# EAGLE schematic DX HRII2 (EAGLE 7.6.0)
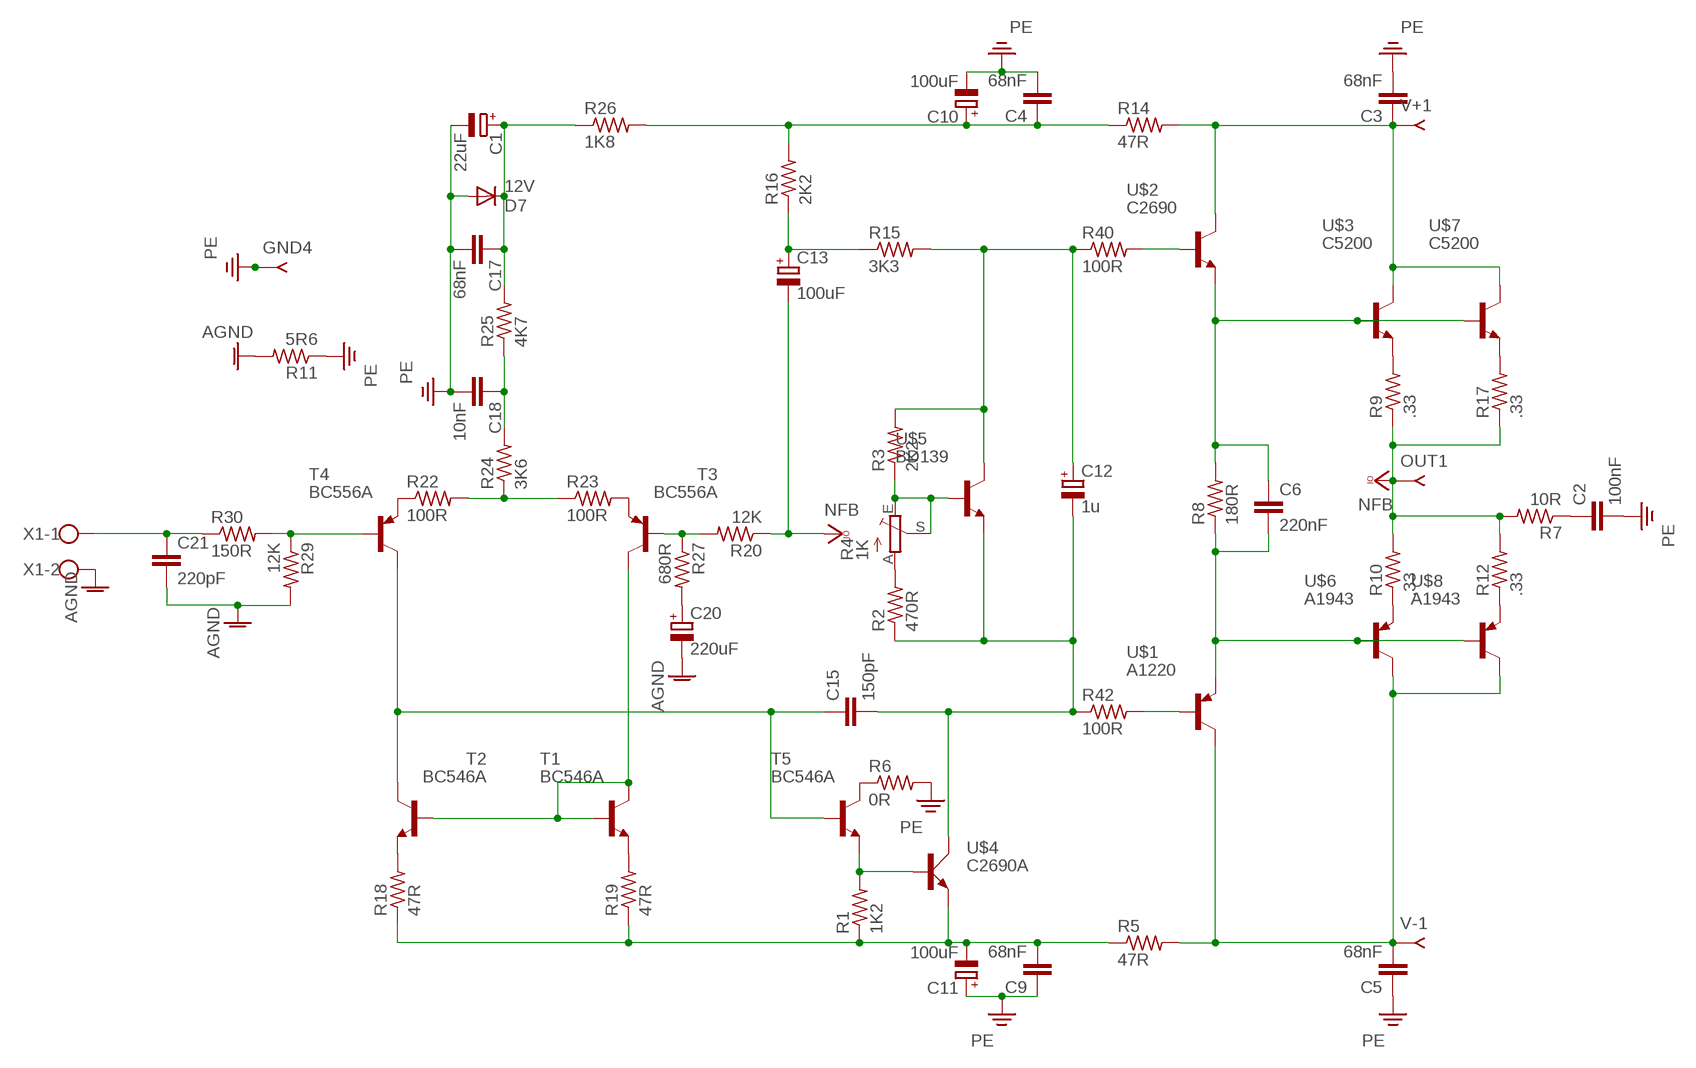
[diagram p0: schematic, sheet 1]

## Parts
C1  22uF  CPOL-EUE2.5-6  [E2,5-6]
C2  100nF  C-EU102-043X133  [C102-043X133]
C3  68nF  C-EU102-043X133  [C102-043X133]
C4  68nF  C-EU050-045X075  [C050-045X075]
C5  68nF  C-EU102-043X133  [C102-043X133]
C6  220nF  C-EU075-052X106  [C075-052X106]
C9  68nF  C-EU050-045X075  [C050-045X075]
C10  100uF  CPOL-EUE5-10.5  [E5-10,5]
C11  100uF  CPOL-EUE5-10.5  [E5-10,5]
C12  1u  CPOL-EUE3.5-8  [E3,5-8]
C13  100uF  CPOL-EUE5-13  [E5-13]
C15  150pF  C-EU050-050X075  [C050-050X075]
C17  68nF  C-EU050-035X075  [C050-035X075]
C18  10nF  C-EU050-055X075  [C050-055X075]
C20  220uF  CPOL-EUE5-10.5  [E5-10,5]
C21  220pF  C-EU050-055X075  [C050-055X075]
D7  12V  1N4004  [DO41-10]
GND4  GND  QFIT  [FASTON]
OUT1  QFIT  [FASTON]
R1  1K2  R-US_0309/12  [0309/12]
R2  470R  R-US_0309/12  [0309/12]
R3  2K2  R-US_0309/10  [0309/10]
R4  1K  TRIM_EU-ECP10P  [ECP10P]
R5  47R  R-US_0309/12  [0309/12]
R6  0R  R-US_0309/12  [0309/12]
R7  10R  R-US_0309/12  [0309/12]
R8  180R  R-US_0309/10  [0309/10]
R9  .33  R-US_0617/22  [0617/22]
R10  .33  R-US_0617/22  [0617/22]
R11  5R6  R-US_0309/10  [0309/10]
R12  .33  R-US_0617/22  [0617/22]
R14  47R  R-US_0309/12  [0309/12]
R15  3K3  R-US_0309/12  [0309/12]
R16  2K2  R-US_0309/12  [0309/12]
R17  .33  R-US_0617/22  [0617/22]
R18  47R  R-US_0309/12  [0309/12]
R19  47R  R-US_0309/12  [0309/12]
R20  12K  R-US_0309/12  [0309/12]
R22  100R  R-US_0309/10  [0309/10]
R23  100R  R-US_0309/10  [0309/10]
R24  3K6  R-US_0309/10  [0309/10]
R25  4K7  R-US_0309/10  [0309/10]
R26  1K8  R-US_0309/12  [0309/12]
R27  680R  R-US_0309/10  [0309/10]
R29  12K  R-US_0309/10  [0309/10]
R30  150R  R-US_0309/12  [0309/12]
R40  100R  R-US_0309/10  [0309/10]
R42  100R  R-US_0309/10  [0309/10]
T1  BC546A  -NPN-TO92-CBE  [TO92-CBE]
T2  BC546A  -NPN-TO92-CBE  [TO92-CBE]
T3  BC556A  -PNP-TO92-CBE  [TO92-CBE]
T4  BC556A  -PNP-TO92-CBE  [TO92-CBE]
T5  BC546A  -NPN-TO92-CBE  [TO92-CBE]
U$1  A1220  2N6107  [TO220]
U$2  C2690  2N5496  [TO220]
U$3  C5200  MJL4281  [TO-264]
U$4  C2690A  TIP41C  [TO220AV]
U$5  BD139  2N4923  [TO126]
U$6  A1943  MJL4302  [TO-264]
U$7  C5200  MJL4281  [TO-264]
U$8  A1943  MJL4302  [TO-264]
V+1  QFIT  [FASTON]
V-1  QFIT  [FASTON]
X1  W237-02P  [W237-132]

## Nets
AGND: C20.- C21.2 R11.2 R29.2 X1.2
N$1: R1.2 T5.E U$4.B
N$2: R3.1 R4.E R4.S U$5.3(B)
N$3: R6.1 T5.C
N$4: C12.+ R3.2 R15.2 R40.1 U$5.2(C)
N$5: R40.2 U$2.1(B)
N$6: C3.1 R14.2 U$2.2(C) U$3.C U$7.C V+1.1 V+1.2
N$7: R2.2 R4.A
N$8: C12.- C15.2 R2.1 R42.1 U$4.C U$5.1(E)
N$9: R42.2 U$1.1(B)
N$10: R9.2 U$3.E
N$11: C2.1 R7.1
N$12: R10.1 U$6.E
N$15: R17.2 U$7.E
N$16: C5.2 R5.2 U$1.2(C) U$6.C U$8.C V-1.1 V-1.2
N$17: C6.1 R8.2 U$2.3(E) U$3.B U$7.B
N$18: R12.1 U$8.E
N$20: C6.2 R8.1 U$1.3(E) U$6.B U$8.B
N$21: C9.2 C11.- R1.1 R5.1 R18.1 R19.1 U$4.E
N$25: C4.1 C10.+ R14.1 R16.2 R26.2
N$28: R29.1 R30.2 T4.B
N$30: C21.1 R30.1 X1.1
N$31: C13.+ R15.1 R16.1
N$34: R20.2 R27.1 T3.B
N$35: R18.2 T2.E
N$36: T1.B T1.C T2.B T3.C
N$37: R22.1 T4.E
N$38: C15.1 T2.C T4.C T5.B
N$39: R19.2 T1.E
N$40: R23.2 T3.E
N$41: R22.2 R23.1 R24.1
N$42: C18.1 R24.2 R25.1
N$43: C1.+ C17.1 D7.C R25.2 R26.1
N$46: C20.+ R27.2
PE: C1.- C2.2 C3.2 C4.2 C5.1 C9.1 C10.- C11.+ C17.2 C18.2 D7.A GND4.1 GND4.2 R6.2 R11.1
VCCIO: C13.- OUT1.1 OUT1.2 R7.2 R9.1 R10.2 R12.2 R17.1 R20.1 ; supply symbol labelled NFB

## Library data of the parts
C1 C10-C13 C20 = resistor:CPOL-EU: POLARIZED CAPACITOR, European symbol
C2-C6 C9 C15 C17 C18 C21 = resistor:C-EU: CAPACITOR, European symbol
D7 = diode:1N4004: DIODE general purpose rectifier, 1 A
GND4 OUT1 V+1 V-1 = keystone:QFIT: QUICKFIT PCB TERMINAL
R1-R3 R5-R12 R14-R20 R22-R27 R29 R30 R40 R42 = resistor:R-US_: RESISTOR, American symbol
R4 = pot:TRIM_EU-: POTENTIOMETER
T1 T2 T5 = transistor-neu-to92:*-NPN-: NPN Transistror
T3 T4 = transistor-neu-to92:*-PNP-: PNP Transistror
U$1 = transistor-pnp:2N6107: PNP Transistor
U$2 = transistor-npn:2N5496: NPN Transistor
U$3 U$7 = Rudi_TO264:MJL4281: MJL4281 NPN BCE TO-264
U$4 = transistor-power:TIP41C: NPN TRANSISTOR
U$5 = transistor-npn:2N4923: NPN Transistor
U$6 U$8 = Rudi_TO264:MJL4302: MJL4302 PNP BCE TO-264
X1 = con-wago-508:W237-02P: WAGO SREW CLAMP